# Altium schematic sheet OSCILLAR_HFB_V1p0_MFILT.SchDoc
size A4; SheetNumber: 4; SheetTotal: 11; Title_: Filter assemly
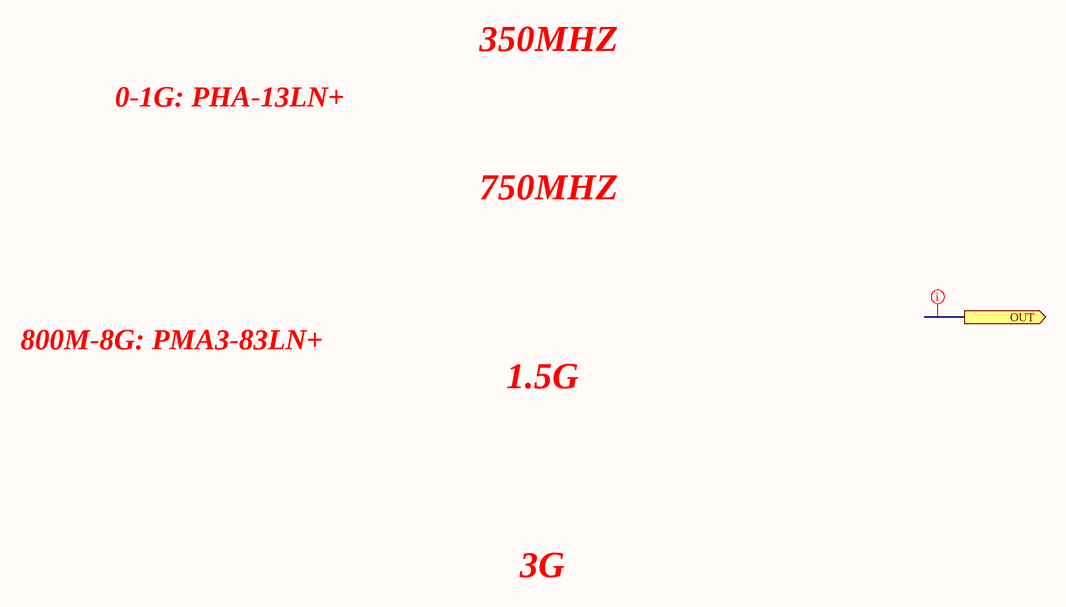
[diagram p0: OSCILLAR_HFB_V1p0_MFILT.SchDoc]

## Ports
OUT (out, see OSCILLAR_HFB_V1p0_MAIN)

## Layout directives
net class 50R: OUT

## Notes on the sheet
- 350MHZ
- 0-1G: PHA-13LN+
- 750MHZ
- 800M-8G: PMA3-83LN+
- 1.5G
- 3G
- Board:
- Author:
- Title:
- Project:
- SVN:
- Version:
- Sheet:
- of
- Contact:
- Modified:
- Size:
- A4